# EAGLE schematic CS GO's C4 (EAGLE 9.6.2)
AUTHOR: Tiago Silva; SOURCE: github.com/TiagoPaulaSilva/CS-GO-s-C4; VERSION: 1.10
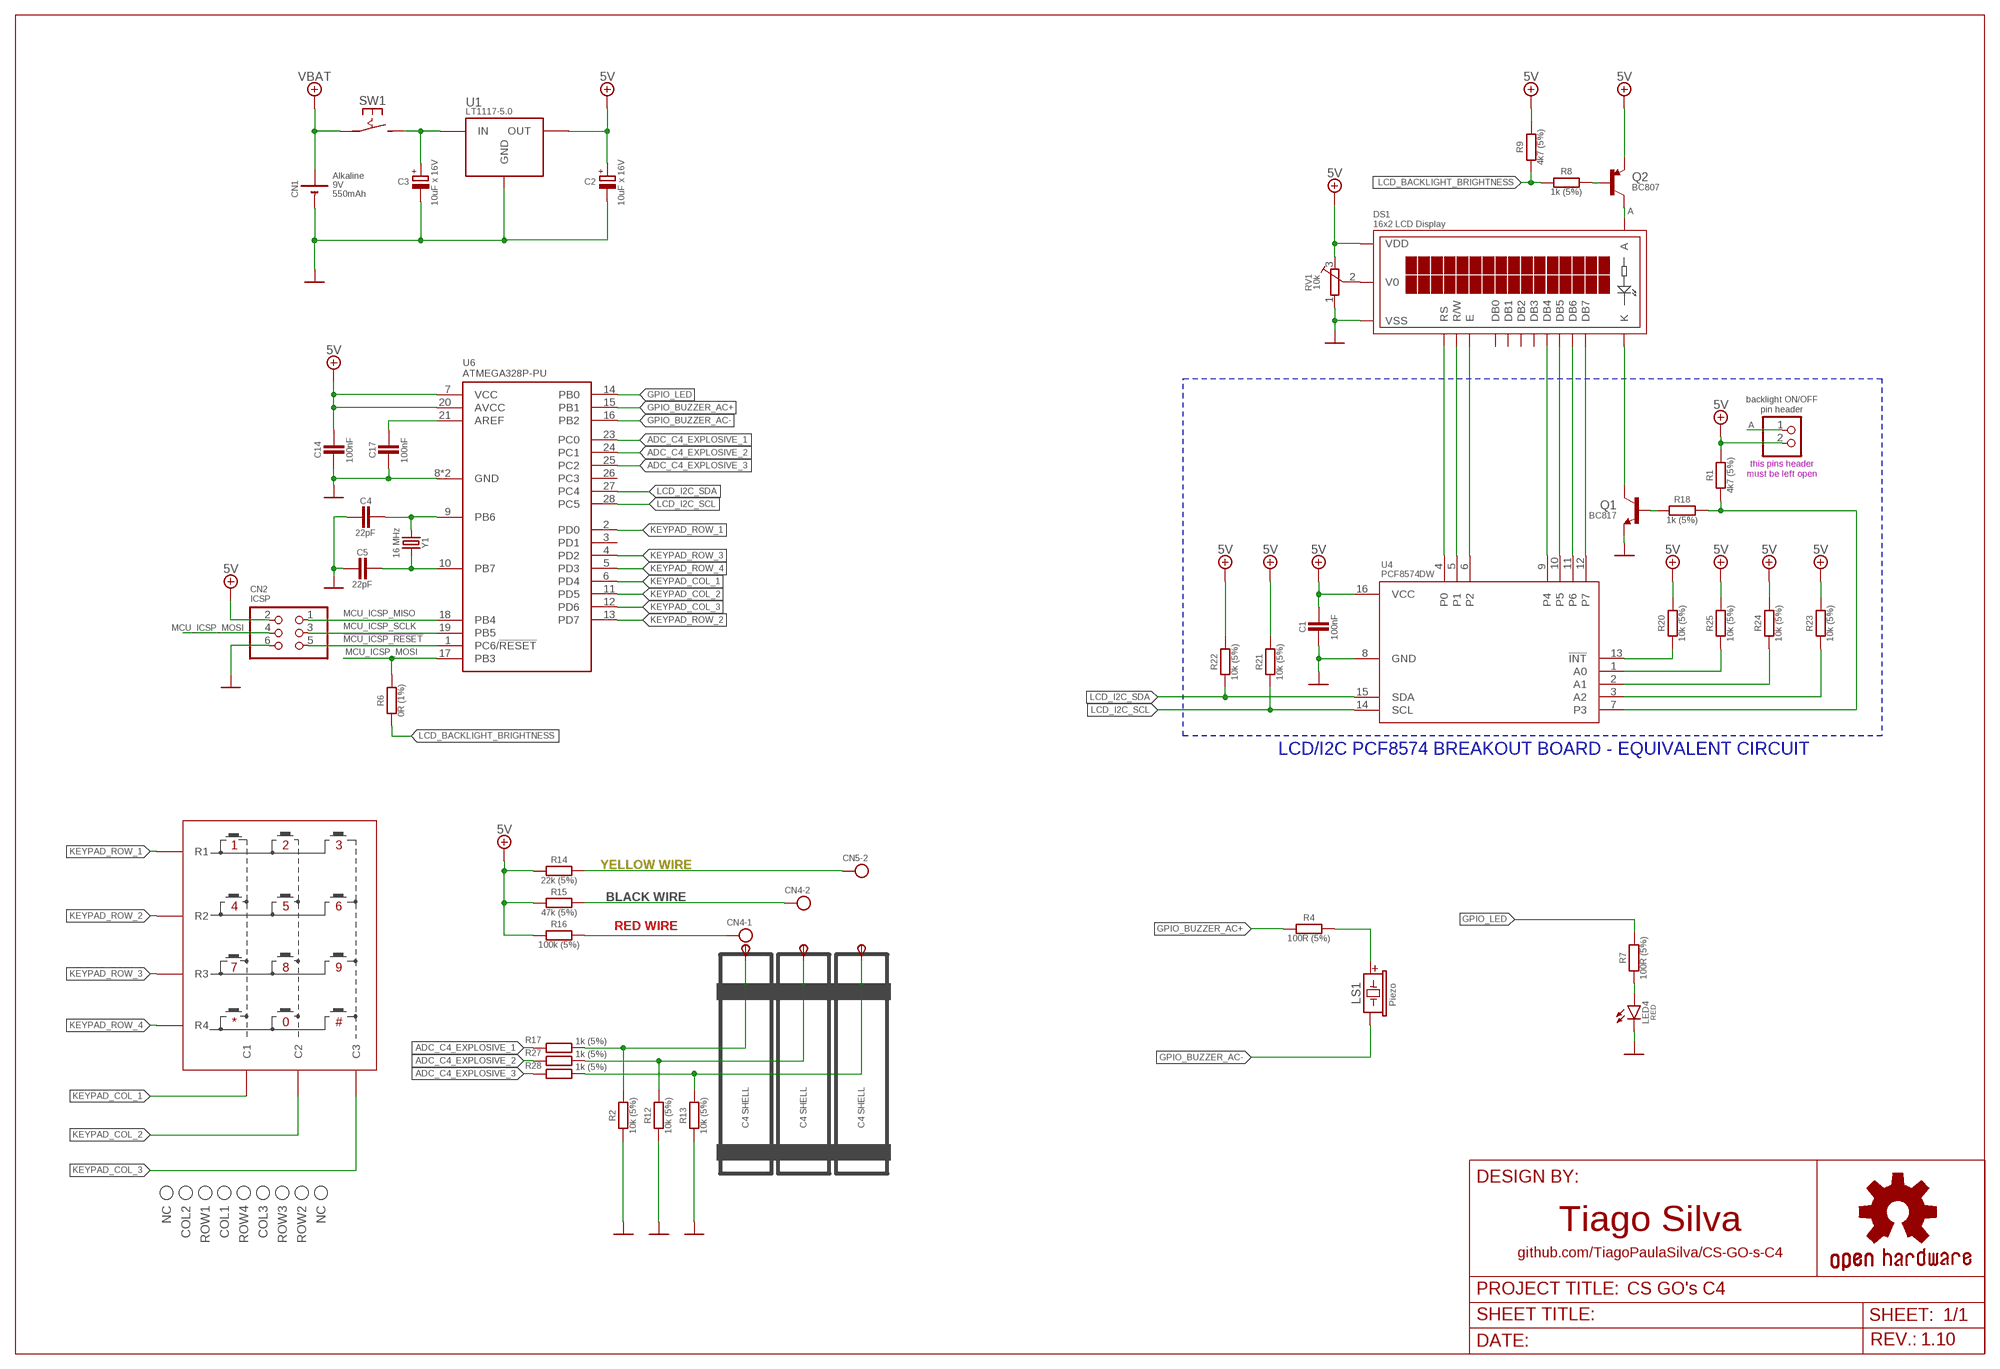
[diagram p0: schematic, sheet 1]

## Parts
C1  100nF  C_0603  [C0603]
C2  10uF x 16V  CP_D12.5_H40  [PTH-D12.5_H40]
C3  10uF x 16V  CP_D12.5_H40  [PTH-D12.5_H40]
C4  22pF  C_0603  [C0603]
C5  22pF  C_0603  [C0603]
C14  100nF  C_0603  [C0603]
C17  100nF  C_0603  [C0603]
CN1  CELL--PHMC4-02  [METALTEX_PH_2P]
CN2  ICSP  PINHD-2X3  [2X03]
CN3  PINHD-1X2  [1X02]
CN4  TERMINAL-BLOCK-2P-5MM  [BLOCK-5MM-2P]
CN5  TERMINAL-BLOCK-2P-5MM  [BLOCK-5MM-2P]
DS1  16x2 LCD Display  16X2  [16X2_MODULE]
KP1  KEYPAD  [KEYPAD]
LED4  RED  LED-LED-PTH-5MM  [LED-PTH-5MM]
LS1  Piezo  ACTIVE-12MM  [12MM]
Q1  NPN-BC817  [SOT23-3]
Q2  PNP-BC807  [SOT23-3]
R1  4k7 (5%)  R_0603  [R0603]
R2  10k (5%)  R_0603  [R0603]
R4  100R (5%)  R_0603  [R0603]
R6  0R (1%)  R_0603  [R0603]
R7  100R (5%)  R_0603  [R0603]
R8  1k (5%)  R_0603  [R0603]
R9  4k7 (5%)  R_0603  [R0603]
R12  10k (5%)  R_0603  [R0603]
R13  10k (5%)  R_0603  [R0603]
R14  22k (5%)  R_0603  [R0603]
R15  47k (5%)  R_0603  [R0603]
R16  100k (5%)  R_0603  [R0603]
R17  1k (5%)  R_0603  [R0603]
R18  1k (5%)  R_0603  [R0603]
R20  10k (5%)  R_0603  [R0603]
R21  10k (5%)  R_0603  [R0603]
R22  10k (5%)  R_0603  [R0603]
R23  10k (5%)  R_0603  [R0603]
R24  10k (5%)  R_0603  [R0603]
R25  10k (5%)  R_0603  [R0603]
R27  1k (5%)  R_0603  [R0603]
R28  1k (5%)  R_0603  [R0603]
RV1  10k  RV_F  [3386F]
SW1  SPST-LATCH-PHMC4-02  [METALTEX_PH_2P]
TP1  TPR-5000-M  [5000-M]
TP2  TPR-5000-M  [5000-M]
TP3  TPR-5000-M  [5000-M]
U1  1117-3.3V  [SOT-223-3]
U4  PCF8574DW  [SOIC127P1030X265-16N]
U6  ATMEGA328P-PU  [PDIP-28]
Y1  16 MHz  OSC-25MHZ  [2MM_1.6MM]

## Nets
0V: C1.2 C2.2(-) C3.2(-) C4.2 C5.2 C14.2 C17.2 CN1.2(-) CN2.6 DS1.1(VSS) LED4.C(K) Q1.2(E) R2.1 R12.1 R13.1 RV1.1 U1.1(GND) U4.8(GND) U6.8(GND) U6.22(GND)
5.0V: C1.1 C2.1(+) C14.1 CN2.2 CN3.2 DS1.2(VDD) Q2.3(C) R1.1 R9.1 R14.1 R15.1 R16.1 R20.2 R21.2 R22.2 R23.2 R24.2 R25.2 RV1.3 U1.2(OUT) U1.4(OUT) U4.16(VCC) U6.7(VCC) U6.20(AVCC) ; supply symbol labelled 5V
!MCU_ICSP_RESET: CN2.5 U6.1(PC6/!RESET)
A: CN3.1 DS1.15(A) Q2.2(E)
ADC_C4_EXPLOSIVE_1: R17.1 U6.23(PC0)
ADC_C4_EXPLOSIVE_2: R27.1 U6.24(PC1)
ADC_C4_EXPLOSIVE_3: R28.1 U6.25(PC2)
GPIO_BUZZER_AC+: R4.1 U6.15(PB1)
GPIO_BUZZER_AC-: LS1.2(-) U6.16(PB2)
GPIO_LED: R7.2 U6.14(PB0)
KEYPAD_COL_1: KP1.4(C1) U6.6(PD4)
KEYPAD_COL_2: KP1.2(C2) U6.11(PD5)
KEYPAD_COL_3: KP1.6(C3) U6.12(PD6)
KEYPAD_ROW_1: KP1.3(R1) U6.2(PD0)
KEYPAD_ROW_2: KP1.8(R2) U6.13(PD7)
KEYPAD_ROW_3: KP1.7(R3) U6.4(PD2)
KEYPAD_ROW_4: KP1.5(R4) U6.5(PD3)
LCD_BACKLIGHT_BRIGHTNESS: R6.1 R8.2 R9.2
LCD_I2C_SCL: R21.1 U4.14(SCL) U6.28(PC5)
LCD_I2C_SDA: R22.1 U4.15(SDA) U6.27(PC4)
MCU_ICSP_MISO: CN2.1 U6.18(PB4)
MCU_ICSP_MOSI: CN2.4 R6.2 U6.17(PB3)
MCU_ICSP_SCLK: CN2.3 U6.19(PB5)
N$1: LS1.1(+) R4.2
N$4: R25.1 U4.1(A0)
N$5: DS1.11(DB4) U4.9(P4)
N$6: C5.1 U6.10(PB7) Y1.3
N$7: DS1.12(DB5) U4.10(P5)
N$8: DS1.13(DB6) U4.11(P6)
N$9: LED4.A R7.1
N$10: C3.1(+) SW1.2(SW2) U1.3(IN)
N$11: CN4.1 R16.2
N$12: C4.1 U6.9(PB6) Y1.1
N$13: DS1.3(V0) RV1.2
N$14: CN4.2 R15.2
N$15: R1.2 R18.1 U4.7(P3)
N$17: DS1.14(DB7) U4.12(P7)
N$18: DS1.6(E) U4.6(P2)
N$19: DS1.5(R/W) U4.5(P1)
N$20: DS1.4(RS) U4.4(P0)
N$21: C17.1 U6.21(AREF)
N$22: Q2.1(B) R8.1
N$23: R2.2 R17.2 TP1.1(P)
N$24: R12.2 R27.2 TP2.1(P)
N$25: R13.2 R28.2 TP3.1(P)
N$26: CN5.2 R14.2
N$32: Q1.1(B) R18.2
N$33: DS1.16(K) Q1.3(C)
N$35: R20.1 U4.13(!INT)
N$38: R24.1 U4.2(A1)
N$39: R23.1 U4.3(A2)
P$1: CN1.1(+) SW1.1(SW1) ; supply symbol labelled VBAT
Unconnected: CN5.1 DS1.7(DB0) DS1.8(DB1) DS1.9(DB2) DS1.10(DB3) U6.3(PD1) U6.26(PC3)

## Notes on the sheet
- backlight ON/OFF
  pin header
- this pins header
  must be left open
- LCD/I2C PCF8574 BREAKOUT BOARD - EQUIVALENT CIRCUIT
- YELLOW WIRE
- BLACK WIRE
- RED WIRE
- C4 SHELL | C4 SHELL | C4 SHELL

## Library data of the parts
C1 C4 C5 C14 C17 = My-RLC:C_: NON-POLARIZED CAP
C2 C3 = My-RLC:CP_: POLARIZED CAP
CN1 = My-Battery:CELL-; CAPACITY: 550mAh; PN: 440054-2; TYPE: Alkaline; VOLTAGE: 9V
CN2 = My-PinHeaders:PINHD-2X3: PIN HEADER
CN3 = My-PinHeaders:PINHD-1X2: PIN HEADER
CN4 CN5 = My-Connectors:TERMINAL-BLOCK-2P: Fixed Terminal Blocks PT 1.5/2-5.0-H; PN: 1935161
DS1 = My-Displays:16X2
KP1 = My-Switches:KEYPAD
LED4 = My-LEDs:LED: LED (Generic) Standard schematic elements and footprints for 5mm, 3mm, 1206, and 0603 sized LEDs. Generic LEDs with no color specified.
LS1 = My-Buzzers:ACTIVE: Piezo Buzzers & Audio Indicators buzzer, 12 mm x 9.5 mm deep, M, 3 V, 85 dB, Through Hole, Integrated Circuit Audio Indicator Source: Datasheet <https://www.arrow.com/en/products/cmi-1295ic-0385t/cui-devices>; DESCRIPTION: Piezo Buzzers & Audio Indicators buzzer, 12 mm x 9.5 mm deep, M, 3 V, 85 dB, Through Hole, Integrated Circuit Audio Indicator; FAMILY: Piezo; HEIGHT: 9.7mm; PN: CMI-1295IC-0385T
Q1 = My-Transistors:NPN-: Bipolar Junction Transistor - NPN; FAMILY: BC817; IC: 500mA; PN: BC817-25,215; VCE: 700mV; VCEO: 45V
Q2 = My-Transistors:PNP-; FAMILY: BC807; IC: -500mA; PN: BC807-25,215; VCE: 700 mV; VCEO: 45V
R1 R2 R4 R6-R9 R12-R18 R20-R25 R27 R28 = My-RLC:R_: RESISTOR
RV1 = My-RLC:RV_: 3386 Series 3/8" Square Trimmer
SW1 = My-Switches:SPST-LATCH; PN: 440054-2
TP1-TP3 = My-TestPoints:TPR: TEST POINT PAD
U1 = My-LDOs:1117-; DESCRIPTION: Voltage Regulator (LDO); FAMILY: LT1117-5.0; IOUT: 800 mA; VDROP: 1.1V; VOUT: 5.0V
U4 = My-ICs:PCF8574DW: Check availability <https://pricing.snapeda.com/parts/PCF8574DW/Texas%20Instruments/view-part?ref=eda>; AVAILABILITY: In Stock; DESCRIPTION: 8-bit 2.5- to 5.5-V I2C/SMBus I/O expander with interrupt; MF: Texas Instruments; PACKAGE: SOIC-16 Texas Instruments; PN: PCF8574DW; PRICE: None; PURCHASE-URL: https://pricing.snapeda.com/search/part/PCF8574DW/?ref=eda
U6 = My-Microcontrollers:ATMEGA328P-PU: AVR AVR® ATmega Microcontroller IC 8-Bit 20MHz 32KB (16K x 16) FLASH 28-PDIP Check availability <https://pricing.snapeda.com/parts/ATMEGA328-PU/Microchip%20Technology/view-part?ref=eda>; ADC: 10-bit; EEPROM: 1 KB; FLASH: 32 KB; PN: ATMEGA328P-PU; RAM: 2 KB
Y1 = My-Crystals:OSC-: Crystals 25MHz Initial Freq Tol. = 30ppm Source: Datasheet <https://www.murata.com/products/productdata/8801076772894/SPEC-XRCGB25M000F3N00R0.pdf?1517925606000>; DESCRIPTION: Crystals 25MHz Initial Freq Tol. = 30ppm; HEIGHT: 0.7mm; MANUFACTURER_NAME: Murata Electronics; MANUFACTURER_PART_NUMBER: XRCGB25M000F3N00R0; MOUSER_PART_NUMBER: 81-XRCGB25M000F3N0R0; MOUSER_PRICE-STOCK: https://www.mouser.co.uk/ProductDetail/Murata-Electronics/XRCGB25M000F3N00R0?qs=r3UZegS7eerrxzrBMfgw7w%3D%3D

## Net classes
2 gnd: width 0.305 mm, drill 0.559 mm, clearance 0.254 mm